# Altium schematic sheet prototype.schdoc
size 215 x 135 mm
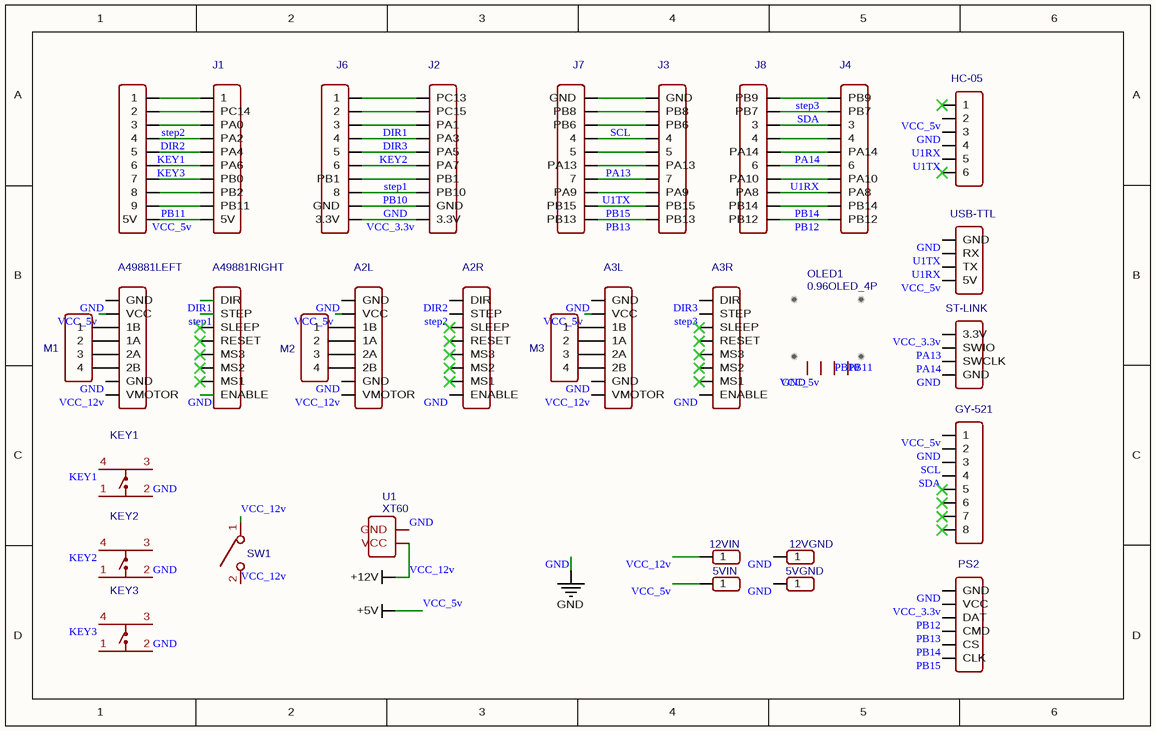
[diagram p0: prototype.schdoc]

## Parts
5VGND  HDR-M-2.54_1x1  [HDR-M-2.54_1X1]  (value not drawn)
5VIN  HDR-M-2.54_1x1  [HDR-M-2.54_1X1]  (value not drawn)
12VGND  HDR-M-2.54_1x1  [HDR-M-2.54_1X1]  (value not drawn)
12VIN  HDR-M-2.54_1x1  [HDR-M-2.54_1X1]  (value not drawn)
A2L  HDR-M-2.54_1x8  [HDR-M-2.54_1X8]  (value not drawn)
A2R  HDR-M-2.54_1x8  [HDR-M-2.54_1X8]  (value not drawn)
A3L  HDR-M-2.54_1x8  [HDR-M-2.54_1X8]  (value not drawn)
A3R  HDR-M-2.54_1x8  [HDR-M-2.54_1X8]  (value not drawn)
A49881LEFT  HDR-M-2.54_1x8  [HDR-M-2.54_1X8]  (value not drawn)
A49881RIGHT  HDR-M-2.54_1x8  [HDR-M-2.54_1X8]  (value not drawn)
GY-521  HDR-M-2.54_1x8  [HDR-M-2.54_1X8]  (value not drawn)
HC-05  HDR-M-2.54_1x6  [HDR-M-2.54_1X6]  (value not drawn)
J1  HDR-M-2.54_1x10  [HDR-M-2.54_1X10]  (value not drawn)
J2  HDR-M-2.54_1x10  [HDR-M-2.54_1X10]  (value not drawn)
J3  HDR-M-2.54_1x10  [HDR-M-2.54_1X10]  (value not drawn)
J4  HDR-M-2.54_1x10  [HDR-M-2.54_1X10]  (value not drawn)
J5  HDR-M-2.54_1x10  [HDR-M-2.54_1X10]  (value not drawn)
J6  HDR-M-2.54_1x10  [HDR-M-2.54_1X10]  (value not drawn)
J7  HDR-M-2.54_1x10  [HDR-M-2.54_1X10]  (value not drawn)
J8  HDR-M-2.54_1x10  [HDR-M-2.54_1X10]  (value not drawn)
KEY1  KEY-6*6*9.5  [KEY-TH_4P-L6.0-W6.0-P4.50-LS7.5]  (value not drawn)
KEY2  KEY-6*6*9.5  [KEY-TH_4P-L6.0-W6.0-P4.50-LS7.5]  (value not drawn)
KEY3  KEY-6*6*9.5  [KEY-TH_4P-L6.0-W6.0-P4.50-LS7.5]  (value not drawn)
M1  HDR-M-2.54_1x4  [HDR-M-2.54_1X4]  (value not drawn)
M2  HDR-M-2.54_1x4  [HDR-M-2.54_1X4]  (value not drawn)
M3  HDR-M-2.54_1x4  [HDR-M-2.54_1X4]  (value not drawn)
OLED1  0.96OLED_4P  [0.96OLED_4P]
PS2  HDR-M-2.54_1x6  [HDR-M-2.54_1X6]  (value not drawn)
ST-LINK  HDR-M-2.54_1x4  [HDR-M-2.54_1X4]  (value not drawn)
SW1  小型 船型/形开关 KCD11 2档2脚 2档3脚 15*10mm 翘板开关  [小型 船型/形开关 KCD11 2档2脚 2档3脚 15*10MM 翘板开关]  (value not drawn)
U1  XT60  [XT60]
USB-TTL  HDR-M-2.54_1x4  [HDR-M-2.54_1X4]  (value not drawn)

## Nets
GND: 5VGND.1 12VGND.1 A2L.1(GND) A2L.7(GND) A2R.8(ENABLE) A3L.1(GND) A3L.7(GND) A3R.8(ENABLE) A49881LEFT.1(GND) A49881LEFT.7(GND) A49881RIGHT.8(ENABLE) GY-521.2 HC-05.3 J2.9(GND) J6.9(GND) KEY1.2 KEY2.2 KEY3.2 OLED1.1 PS2.6(GND) ST-LINK.4(GND) U1.2(GND) USB-TTL.1(GND)
VCC_5v: 5VIN.1 A2L.2(VCC) A3L.2(VCC) A49881LEFT.2(VCC) GY-521.1 HC-05.2 J1.10(5V) J5.10(5V) OLED1.2 USB-TTL.4(5V)  [also labelled +5V]
VCC_12v: 12VIN.1 A2L.8(VMOTOR) A3L.8(VMOTOR) A49881LEFT.8(VMOTOR) SW1.1 SW1.2 U1.1(VCC)  [also labelled +12V]
DIR1: A49881RIGHT.1(DIR) J2.3(PA1) J6.3
DIR2: A2R.1(DIR) J1.4(PA2) J5.4
DIR3: A3R.1(DIR) J2.4(PA3) J6.4
KEY1: J1.5(PA4) J5.5 KEY1.4
KEY2: J2.5(PA5) J6.5 KEY2.4
KEY3: J1.6(PA6) J5.6 KEY3.4
PA13: J3.6(PA13) J7.6(PA13) ST-LINK.2(SWIO)
PA14: J4.5(PA14) J8.5(PA14) ST-LINK.3(SWCLK)
PB10: J2.8(PB10) J6.8 OLED1.3
PB11: J1.9(PB11) J5.9 OLED1.4
PB12: J4.10(PB12) J8.10(PB12) PS2.4(DAT)
PB13: J3.10(PB13) J7.10(PB13) PS2.3(CMD)
PB14: J4.9(PB14) J8.9(PB14) PS2.2(CS)
PB15: J3.9(PB15) J7.9(PB15) PS2.1(CLK)
SCL: GY-521.3 J3.3(PB6) J7.3(PB6)
SDA: GY-521.4 J4.2(PB7) J8.2(PB7)
step1: A49881RIGHT.2(STEP) J2.7(PB1) J6.7(PB1)
step2: A2R.2(STEP) J1.3(PA0) J5.3
step3: A3R.2(STEP) J4.1(PB9) J8.1(PB9)
U1RX: HC-05.4 J4.7(PA10) J8.7(PA10) USB-TTL.3(TX)
U1TX: HC-05.5 J3.8(PA9) J7.8(PA9) USB-TTL.2(RX)
VCC_3.3v: J2.10(3.3V) J6.10(3.3V) PS2.5(VCC) ST-LINK.1(3.3V)
NetA2L_3: A2L.3(1B) M2.1
NetA2L_4: A2L.4(1A) M2.2
NetA2L_5: A2L.5(2A) M2.3
NetA2L_6: A2L.6(2B) M2.4
NetA3L_3: A3L.3(1B) M3.1
NetA3L_4: A3L.4(1A) M3.2
NetA3L_5: A3L.5(2A) M3.3
NetA3L_6: A3L.6(2B) M3.4
NetA49881LEFT_3: A49881LEFT.3(1B) M1.1
NetA49881LEFT_4: A49881LEFT.4(1A) M1.2
NetA49881LEFT_5: A49881LEFT.5(2A) M1.3
NetA49881LEFT_6: A49881LEFT.6(2B) M1.4
NetJ1_1: J1.1 J5.1
NetJ1_2: J1.2(PC14) J5.2
NetJ1_7: J1.7(PB0) J5.7
NetJ1_8: J1.8(PB2) J5.8
NetJ2_1: J2.1(PC13) J6.1
NetJ2_2: J2.2(PC15) J6.2
NetJ2_6: J2.6(PA7) J6.6
NetJ3_1: J3.1(GND) J7.1(GND)
NetJ3_2: J3.2(PB8) J7.2(PB8)
NetJ3_4: J3.4 J7.4
NetJ3_5: J3.5 J7.5
NetJ3_7: J3.7 J7.7
NetJ4_3: J4.3 J8.3
NetJ4_4: J4.4 J8.4
NetJ4_6: J4.6 J8.6
NetJ4_8: J4.8(PA8) J8.8(PA8)

Not connected (* = marked no-connect by the designer): A2R 3(SLEEP)* 4(RESET)* 5(MS3)* 6(MS2)* 7(MS1)*; A3R 3(SLEEP)* 4(RESET)* 5(MS3)* 6(MS2)* 7(MS1)*; A49881RIGHT 3(SLEEP)* 4(RESET)* 5(MS3)* 6(MS2)* 7(MS1)*; GY-521 5* 6* 7* 8*; HC-05 1* 6*; KEY1 1 3; KEY2 1 3; KEY3 1 3

## Notes on the sheet
- (in symbol 0.96OLED_4P) Hello World!!!

## Library data of the parts
5VGND 5VIN 12VGND 12VIN = HDR-M-2.54_1x1: Contributor: LCEDA_Lib; BOM_Supplier Part: C81276; BOM_Supplier: LCSC; spicePre: J; spiceSymbolName: HDR-M-2.54_1x1
A2L A2R A3L A3R A49881LEFT A49881RIGHT GY-521 = HDR-M-2.54_1x8: Contributor: LCEDA_Lib; BOM_Supplier Part: C190820; BOM_Supplier: LCSC; spicePre: J; spiceSymbolName: HDR-M-2.54_1x8
HC-05 PS2 = HDR-M-2.54_1x6: Contributor: LCEDA_Lib; BOM_Supplier Part: C190819; BOM_Supplier: LCSC; spicePre: J; spiceSymbolName: HDR-M-2.54_1x6
J1-J8 = HDR-M-2.54_1x10: Contributor: LCEDA_Lib; BOM_Supplier Part: C57369; BOM_Supplier: LCSC; spicePre: J; spiceSymbolName: HDR-M-2.54_1x10
KEY1-KEY3 = KEY-6*6*9.5: BOM_Manufacturer: ReliaPro; BOM_Manufacturer Part: 直插轻触开关 6*6*9.5; BOM_Supplier Part: C22546; BOM_Supplier: LCSC; spicePre: K; spiceSymbolName: KEY-6*6*9.5
M1-M3 ST-LINK USB-TTL = HDR-M-2.54_1x4: Contributor: LCEDA_Lib; BOM_Supplier Part: C124378; BOM_Supplier: LCSC; spicePre: J; spiceSymbolName: HDR-M-2.54_1x4
OLED1 = 0.96OLED_4P: Contributor: LCEDA_Lib; BOM_Supplier: LCSC; spicePre: O; spiceSymbolName: 0.96OLED_4P
SW1 = 小型 船型/形开关 KCD11 2档2脚 2档3脚 15*10mm 翘板开关: BOM_Manufacturer: Legion; BOM_Manufacturer Part: SS01-BBIWL-RP20-R; Contributor: CyTech; BOM_Supplier: LCSC; BOM_Supplier Part: C309064; spicePre: S; spiceSymbolName: 小型 船型/形开关 KCD11 2档2脚 2档3脚 15*10mm 翘板开关
U1 = XT60: Contributor: AKER; BOM_Manufacturer: -; BOM_Manufacturer Part: -; BOM_Supplier Part: -; link: -; spicePre: U; spiceSymbolName: XT60